# Altium project EEG.PrjPcb
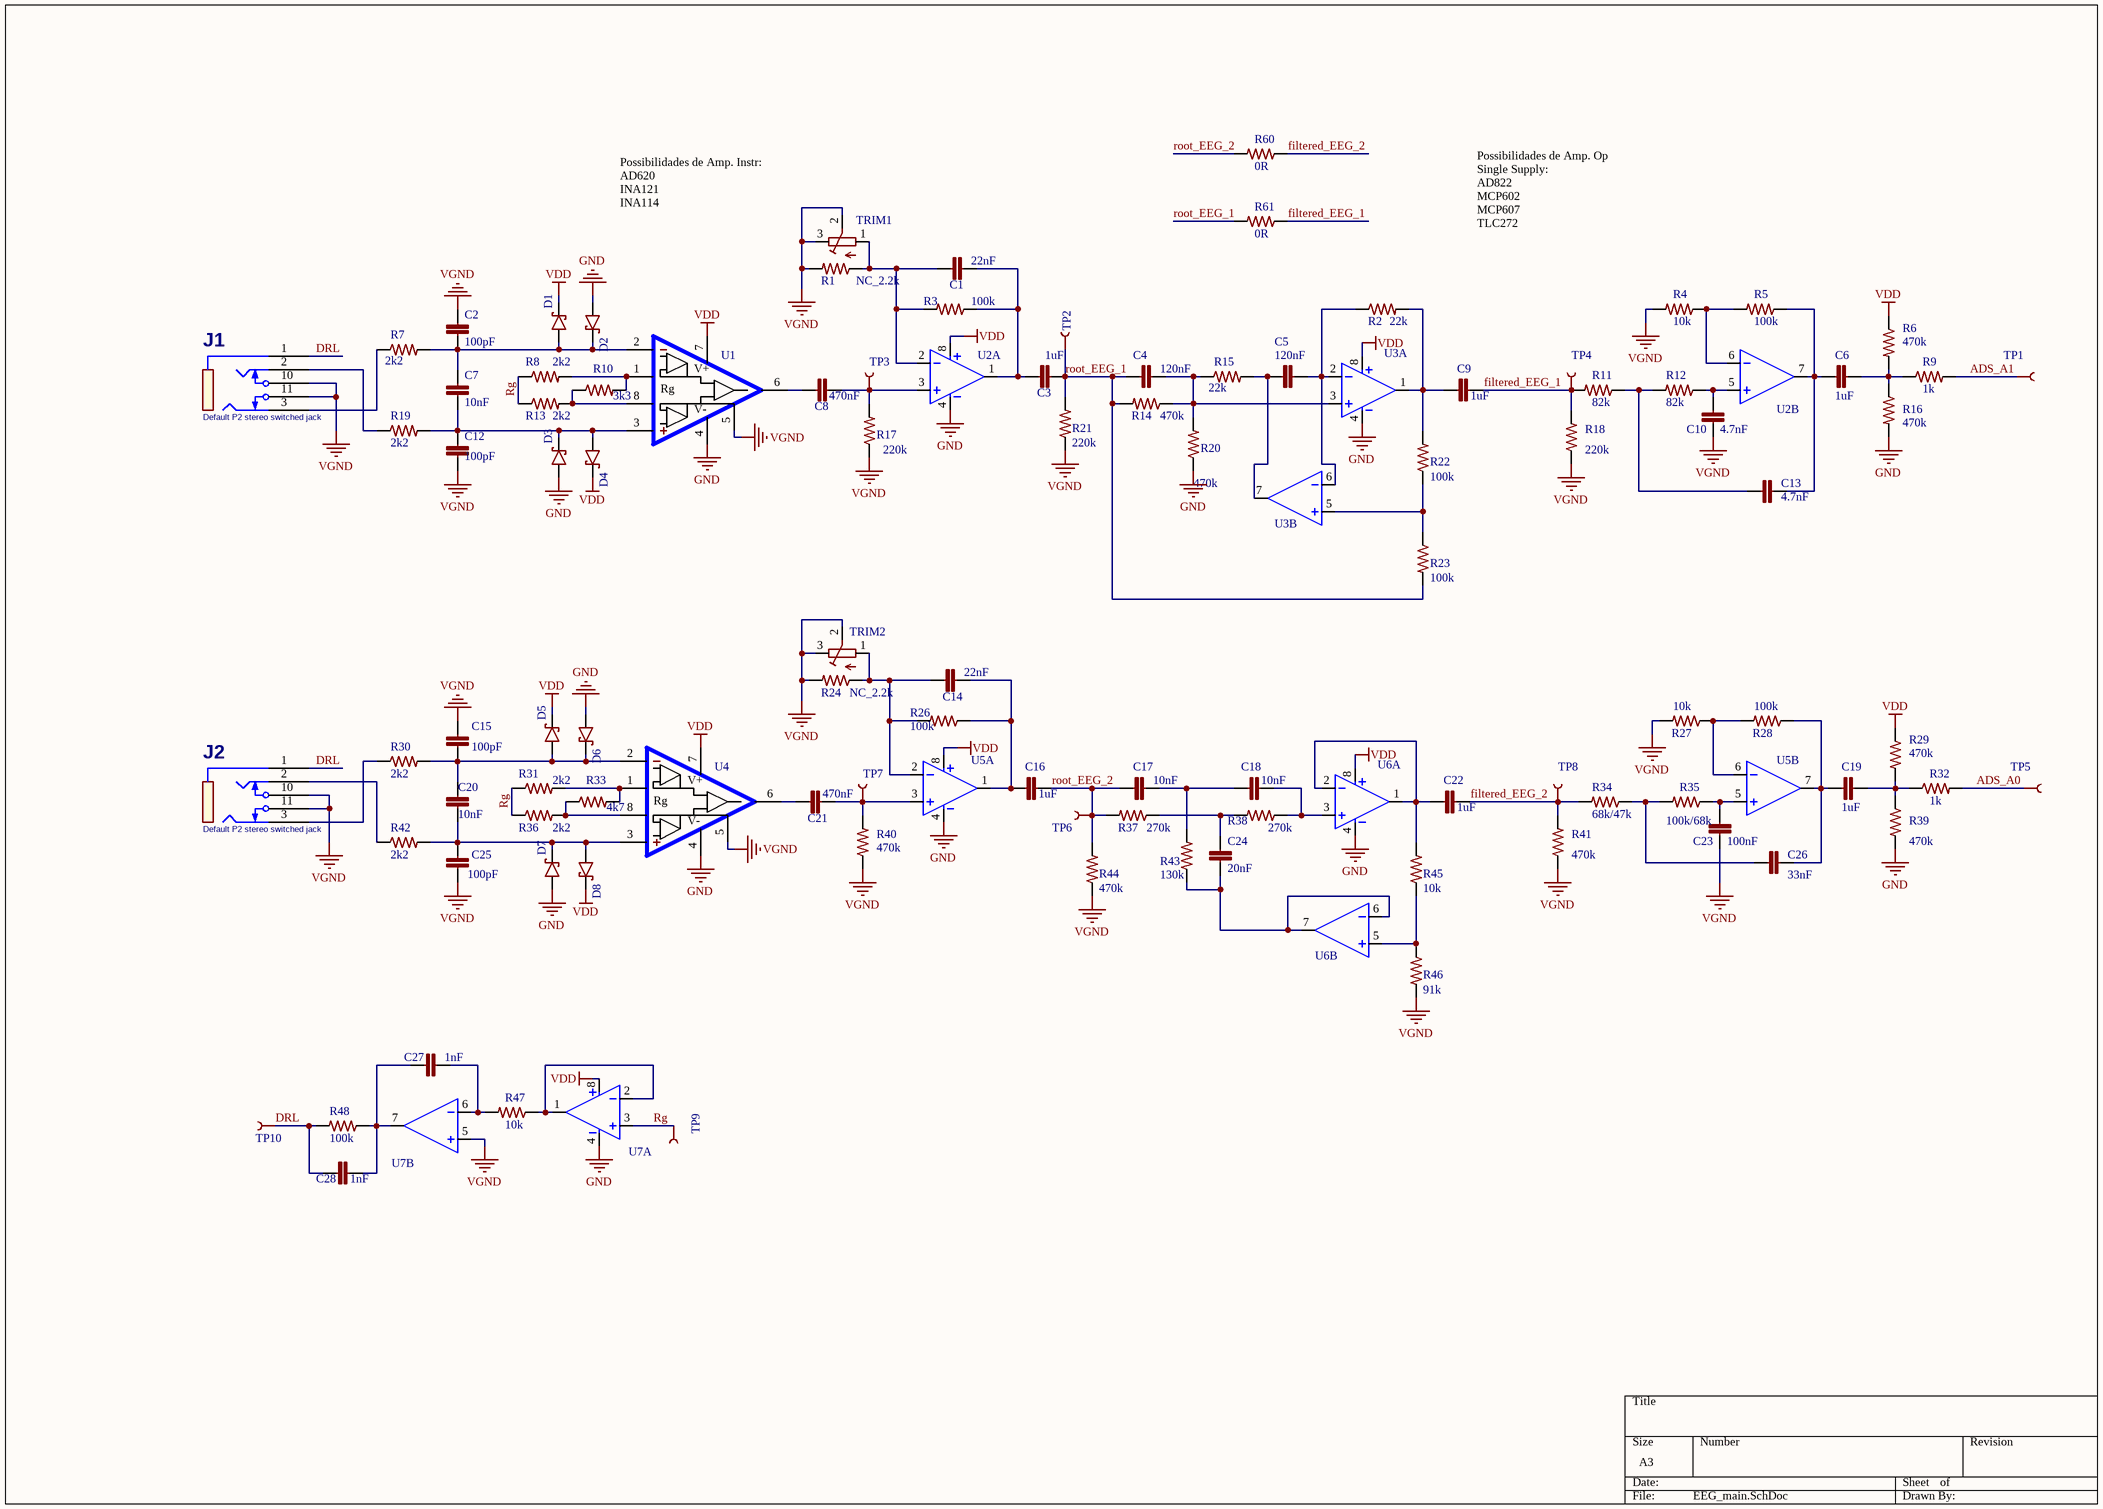
[diagram p0: EEG_main.SchDoc]
2 sheets, 136 parts. Net scope: global (net labels, ports and power ports of the same name join across sheets).
Board file: EEG.PcbDoc
Sheets:
  EEG_main.SchDoc
  EEG_Power_Connector_ESP32.SchDoc

## Sheet EEG_main.SchDoc
size A3

### Parts
C1  22nF  [C0805 - rounded]
C2  100pF  [C0805 - rounded]
C3  1uF  [C0805 - rounded]
C4  120nF  [C0805 - rounded]
C5  120nF  [C0805 - rounded]
C6  1uF  [C0805 - rounded]
C7  10nF  [C0805 - rounded]
C8  470nF  [C0805 - rounded]
C9  1uF  [C0805 - rounded]
C10  4.7nF  [C0805 - rounded]
C12  100pF  [C0805 - rounded]
C13  4.7nF  [C0805 - rounded]
C14  22nF  [C0805 - rounded]
C15  100pF  [C0805 - rounded]
C16  1uF  [C0805 - rounded]
C17  10nF  [C0805 - rounded]
C18  10nF  [C0805 - rounded]
C19  1uF  [C0805 - rounded]
C20  10nF  [C0805 - rounded]
C21  470nF  [C0805 - rounded]
C22  1uF  [C0805 - rounded]
C23  100nF  [C0805 - rounded]
C24  20nF  [C0805 - rounded]
C25  100pF  [C0805 - rounded]
C26  33nF  [C0805 - rounded]
C27  1nF  [C0805 - rounded]
C28  1nF  [C0805 - rounded]
D1  DIODE  [DO214AA]  (value not drawn)
D2  DIODE  [DO214AA]  (value not drawn)
D3  DIODE  [DO214AA]  (value not drawn)
D4  DIODE  [DO214AA]  (value not drawn)
D5  DIODE  [DO214AA]  (value not drawn)
D6  DIODE  [DO214AA]  (value not drawn)
D7  DIODE  [DO214AA]  (value not drawn)
D8  DIODE  [DO214AA]  (value not drawn)
J1  Default P2 stereo switched jack  [phone jack - SJ1-352x]
J2  Default P2 stereo switched jack  [phone jack - SJ1-352x]
R1  NC_2.2k  [R0805 - rounded]
R2  22k  [R0805 - rounded]
R3  100k  [R0805 - rounded]
R4  10k  [R0805 - rounded]
R5  100k  [R0805 - rounded]
R6  470k  [R0805 - rounded]
R7  2k2  [R0805 - rounded]
R8  2k2  [R0805 - rounded]
R9  1k  [R0805 - rounded]
R10  3k3  [R0805 - rounded]
R11  82k  [R0805 - rounded]
R12  82k  [R0805 - rounded]
R13  2k2  [R0805 - rounded]
R14  470k  [R0805 - rounded]
R15  22k  [R0805 - rounded]
R16  470k  [R0805 - rounded]
R17  220k  [R0805 - rounded]
R18  220k  [R0805 - rounded]
R19  2k2  [R0805 - rounded]
R20  470k  [R0805 - rounded]
R21  220k  [R0805 - rounded]
R22  100k  [R0805 - rounded]
R23  100k  [R0805 - rounded]
R24  NC_2.2k  [R0805 - rounded]
R26  100k  [R0805 - rounded]
R27  10k  [R0805 - rounded]
R28  100k  [R0805 - rounded]
R29  470k  [R0805 - rounded]
R30  2k2  [R0805 - rounded]
R31  2k2  [R0805 - rounded]
R32  1k  [R0805 - rounded]
R33  4k7  [R0805 - rounded]
R34  68k/47k  [R0805 - rounded]
R35  100k/68k  [R0805 - rounded]
R36  2k2  [R0805 - rounded]
R37  270k  [R0805 - rounded]
R38  270k  [R0805 - rounded]
R39  470k  [R0805 - rounded]
R40  470k  [R0805 - rounded]
R41  470k  [R0805 - rounded]
R42  2k2  [R0805 - rounded]
R43  130k  [R0805 - rounded]
R44  470k  [R0805 - rounded]
R45  10k  [R0805 - rounded]
R46  91k  [R0805 - rounded]
R47  10k  [R0805 - rounded]
R48  100k  [R0805 - rounded]
R60  0R  [R0805 - rounded]
R61  0R  [R0805 - rounded]
TP1  SparkFun Test Points    Bare copper test points for troubleshooting or In-Circuit-Testing. These are used by our Production team for verifying production board runs using pogo-pins on test beds.   SparkFun Products: SparkFun LSM9DS1 Breakout  SparkFun PSOC  SparkFun Load Cell Amplifier  [PAD.03X.03]  (value not drawn)
TP2  SparkFun Test Points    Bare copper test points for troubleshooting or In-Circuit-Testing. These are used by our Production team for verifying production board runs using pogo-pins on test beds.   SparkFun Products: SparkFun LSM9DS1 Breakout  SparkFun PSOC  SparkFun Load Cell Amplifier  [PAD.03X.03]  (value not drawn)
TP3  SparkFun Test Points    Bare copper test points for troubleshooting or In-Circuit-Testing. These are used by our Production team for verifying production board runs using pogo-pins on test beds.   SparkFun Products: SparkFun LSM9DS1 Breakout  SparkFun PSOC  SparkFun Load Cell Amplifier  [PAD.03X.03]  (value not drawn)
TP4  SparkFun Test Points    Bare copper test points for troubleshooting or In-Circuit-Testing. These are used by our Production team for verifying production board runs using pogo-pins on test beds.   SparkFun Products: SparkFun LSM9DS1 Breakout  SparkFun PSOC  SparkFun Load Cell Amplifier  [PAD.03X.03]  (value not drawn)
TP5  SparkFun Test Points    Bare copper test points for troubleshooting or In-Circuit-Testing. These are used by our Production team for verifying production board runs using pogo-pins on test beds.   SparkFun Products: SparkFun LSM9DS1 Breakout  SparkFun PSOC  SparkFun Load Cell Amplifier  [PAD.03X.03]  (value not drawn)
TP6  SparkFun Test Points    Bare copper test points for troubleshooting or In-Circuit-Testing. These are used by our Production team for verifying production board runs using pogo-pins on test beds.   SparkFun Products: SparkFun LSM9DS1 Breakout  SparkFun PSOC  SparkFun Load Cell Amplifier  [PAD.03X.03]  (value not drawn)
TP7  SparkFun Test Points    Bare copper test points for troubleshooting or In-Circuit-Testing. These are used by our Production team for verifying production board runs using pogo-pins on test beds.   SparkFun Products: SparkFun LSM9DS1 Breakout  SparkFun PSOC  SparkFun Load Cell Amplifier  [PAD.03X.03]  (value not drawn)
TP8  SparkFun Test Points    Bare copper test points for troubleshooting or In-Circuit-Testing. These are used by our Production team for verifying production board runs using pogo-pins on test beds.   SparkFun Products: SparkFun LSM9DS1 Breakout  SparkFun PSOC  SparkFun Load Cell Amplifier  [PAD.03X.03]  (value not drawn)
TP9  SparkFun Test Points    Bare copper test points for troubleshooting or In-Circuit-Testing. These are used by our Production team for verifying production board runs using pogo-pins on test beds.   SparkFun Products: SparkFun LSM9DS1 Breakout  SparkFun PSOC  SparkFun Load Cell Amplifier  [PAD.03X.03]  (value not drawn)
TP10  SparkFun Test Points    Bare copper test points for troubleshooting or In-Circuit-Testing. These are used by our Production team for verifying production board runs using pogo-pins on test beds.   SparkFun Products: SparkFun LSM9DS1 Breakout  SparkFun PSOC  SparkFun Load Cell Amplifier  [PAD.03X.03]  (value not drawn)
TRIM1  R-TRIMM  [RTRIM3386]  (value not drawn)
TRIM2  R-TRIMM  [RTRIM3386]  (value not drawn)
U1  AD620  [SOIC8]  (value not drawn)
U2  MCP602  [SOIC8]  (value not drawn)  (parts A,B of 2)
U3  MCP602  [SOIC8]  (value not drawn)  (parts A,B of 2)
U4  AD620  [SOIC8]  (value not drawn)
U5  MCP602  [SOIC8]  (value not drawn)  (parts A,B of 2)
U6  MCP602  [SOIC8]  (value not drawn)  (parts A,B of 2)
U7  MCP602  [SOIC8]  (value not drawn)  (parts A,B of 2)

### Nets
GND: D2.A D3.A D6.A D7.A R16.2 R20.1 R39.2 U1.4(V-) U2.4(V-) U3.4(V-) U4.4(V-) U5.4(V-) U6.4(V-) U7.4(V-)
VDD: D1.C D4.C D5.C D8.C R6.1 R29.1 U1.7(V+) U2.8(V+) U3.8(V+) U4.7(V+) U5.8(V+) U6.8(V+) U7.8(V+)
VGND: C2.2 C10.1 C12.2 C15.2 C23.1 C25.2 J1.10(TIP_SW) J1.11(RING_SW) J2.10(TIP_SW) J2.11(RING_SW) R1.2 R4.2 R17.1 R18.1 R21.1 R24.2 R27.2 R40.1 R41.1 R44.1 R46.2 TRIM1.2(S) TRIM1.3(E) TRIM2.2(S) TRIM2.3(E) U1.5(REF) U4.5(REF) U7.5(+IN)  [project net 2.5Vref]
ADS_A0: R32.2 TP5.P$1
ADS_A1: R9.2 TP1.P$1
DRL: C28.1 J1.1(SLEEVE) J2.1(SLEEVE) R48.2 TP10.P$1
filtered_EEG_1: C9.2 R11.2 R18.2 R61.1 TP4.P$1
filtered_EEG_2: C22.2 R34.2 R41.2 R60.1 TP8.P$1
Rg: R8.1 R13.1 R31.1 R36.1 TP9.P$1 U7.3(+IN)
root_EEG_1: C3.2 C4.1 R14.2 R21.2 R23.2 R61.2 TP2.P$1
root_EEG_2: C16.2 C17.1 R37.2 R44.2 R60.2 TP6.P$1
NetC1_1: C1.1 R1.1 R3.2 TRIM1.1(A) U2.2(-IN)
NetC1_2: C1.2 C3.1 R3.1 U2.1(OUT)
NetC2_1: C2.1 C7.2 D1.A D2.C R7.2 U1.2(-IN)
NetC4_2: C4.2 R14.1 R15.1 R20.2 U3.3(+IN)
NetC5_1: C5.1 R15.2 U3.7(OUT)
NetC5_2: C5.2 R2.1 U3.2(-IN) U3.6(-IN)
NetC6_1: C6.1 C13.1 R5.1 U2.7(OUT)
NetC6_2: C6.2 R6.2 R9.1 R16.1
NetC7_1: C7.1 C12.1 D3.C D4.A R19.2 U1.3(+IN)
NetC8_1: C8.1 U1.6(OUT)
NetC8_2: C8.2 R17.2 TP3.P$1 U2.3(+IN)
NetC9_1: C9.1 R2.2 R22.2 U3.1(OUT)
NetC10_2: C10.2 R12.1 U2.5(+IN)
NetC13_2: C13.2 R11.1 R12.2
NetC14_1: C14.1 R24.1 R26.2 TRIM2.1(A) U5.2(-IN)
NetC14_2: C14.2 C16.1 R26.1 U5.1(OUT)
NetC15_1: C15.1 C20.2 D5.A D6.C R30.2 U4.2(-IN)
NetC17_2: C17.2 C18.1 R43.2
NetC18_2: C18.2 R38.1 U6.3(+IN)
NetC19_1: C19.1 C26.1 R28.1 U5.7(OUT)
NetC19_2: C19.2 R29.2 R32.1 R39.1
NetC20_1: C20.1 C25.1 D7.C D8.A R42.2 U4.3(+IN)
NetC21_1: C21.1 U4.6(OUT)
NetC21_2: C21.2 R40.2 TP7.P$1 U5.3(+IN)
NetC22_1: C22.1 R45.2 U6.1(OUT) U6.2(-IN)
NetC23_2: C23.2 R35.1 U5.5(+IN)
NetC24_1: C24.1 R43.1 U6.6(-IN) U6.7(OUT)
NetC24_2: C24.2 R37.1 R38.2
NetC26_2: C26.2 R34.1 R35.2
NetC27_1: C27.1 C28.2 R48.1 U7.7(OUT)
NetC27_2: C27.2 R47.2 U7.6(-IN)
NetJ1_2: J1.2(TIP) R19.1
NetJ1_3: J1.3(RING) R7.1
NetJ2_2: J2.2(TIP) R42.1
NetJ2_3: J2.3(RING) R30.1
NetR4_1: R4.1 R5.2 U2.6(-IN)
NetR8_2: R8.2 R10.2 U1.1(Rg)
NetR10_1: R10.1 R13.2 U1.8(Rg)
NetR22_1: R22.1 R23.1 U3.5(+IN)
NetR27_1: R27.1 R28.2 U5.6(-IN)
NetR31_2: R31.2 R33.2 U4.1(Rg)
NetR33_1: R33.1 R36.2 U4.8(Rg)
NetR45_1: R45.1 R46.1 U6.5(+IN)
NetR47_1: R47.1 U7.1(OUT) U7.2(-IN)

### Notes on the sheet
- Possibilidades de Amp. Instr:
  AD620
  INA121
  INA114
- Possibilidades de Amp. Op Single Supply:
  AD822
  MCP602
  MCP607
  TLC272

### Library data of the parts
C1-C10 C12-C28 = C-EU-SMD: Generic Capacitor SMD
  C1 C14: Value: 22nF
  C2 C12 C15 C25: Value: 100pF
  C3 C6 C9 C16 C19 C22: Value: 1uF
  C4 C5: Value: 120nF
  C7 C17 C18 C20: Value: 10nF
  C8 C21: Value: 470nF
  C10 C13: Value: 4.7nF
  C23: Value: 100nF
  C24: Value: 20nF
  C26: Value: 33nF
  C27 C28: Value: 1nF
D1-D8 = SCHOTTKY-DIODE: Part Number: SS12
J1 J2 = PHONEJACK - SJ1-352x
R1-R24 R26-R48 R60 R61 = R-US-SMD: Generic Resistor SMD
  R1 R24: Value: NC_2.2k
  R2 R15: Value: 22k
  R3 R5 R22 R23 R26 R28 R48: Value: 100k
  R4 R27 R45 R47: Value: 10k
  R6 R14 R16 R20 R29 R39-R41 R44: Value: 470k
  R7 R8 R13 R19 R30 R31 R36 R42: Value: 2k2
  R9 R32: Value: 1k
  R10: Value: 3k3
  R11 R12: Value: 82k
  R17 R18 R21: Value: 220k
  R33: Value: 4k7
  R34: Value: 68k/47k
  R35: Value: 100k/68k
  R37 R38: Value: 270k
  R43: Value: 130k
  R46: Value: 91k
  R60 R61: Value: 0R
TP1-TP10 = TEST-POINT2
TRIM1 TRIM2 = R-TRIMM: Value: 100k
U1 U4 = AD620: Low Cost Low Power Instrumentation Amplifier
U2 U3 U5 U6 = MCP602: Operational Amplifiers - Op Amps Dual 2.7V; Vendor: Microchip; Part Number: MCP602
U7 = TL082: Wide Bandwidth Dual JFET Input Op Amp; Part Number: MCP602

## Sheet EEG_Power_Connector_ESP32.SchDoc
size A4
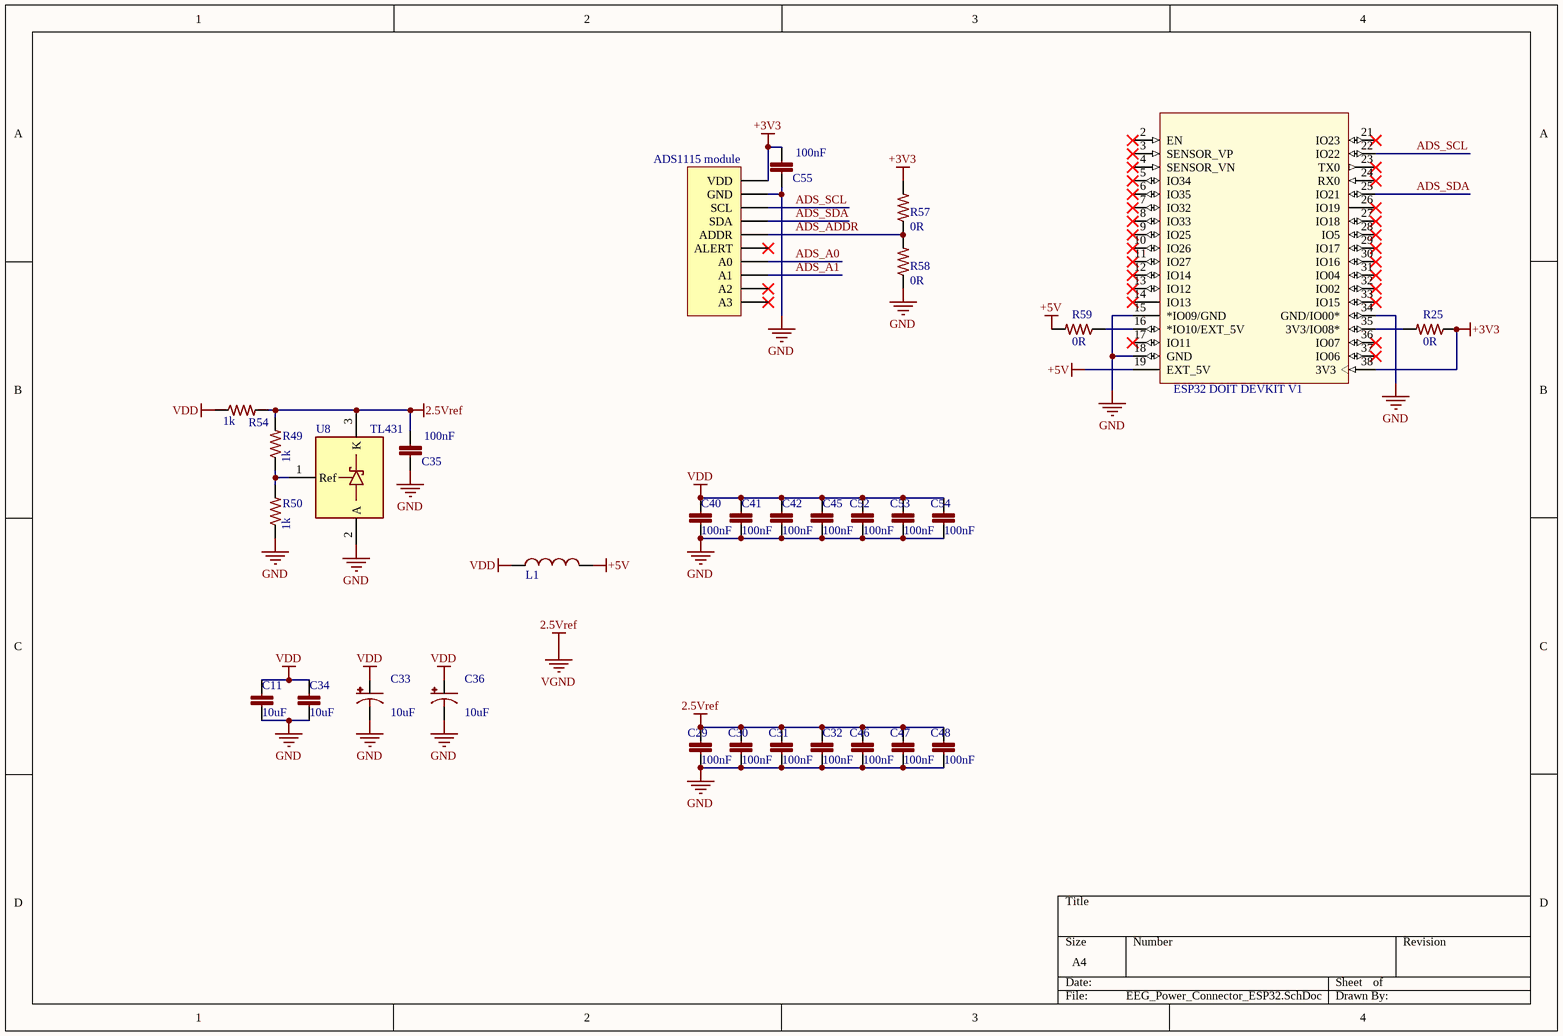
[diagram p1: EEG_Power_Connector_ESP32.SchDoc]

### Parts
A2  ESP32 DOIT DEVKIT V1  [MODULE_ESP32-DOIT_DEVKIT-36P]
A4  ADS1115 module  [ADS1115 Module - horizontal]
C11  10uF  [C0805 - rounded]
C29  100nF  [C0805 - rounded]
C30  100nF  [C0805 - rounded]
C31  100nF  [C0805 - rounded]
C32  100nF  [C0805 - rounded]
C33  10uF  [E1,8-4]
C34  10uF  [C0805 - rounded]
C35  100nF  [C0805 - rounded]
C36  10uF  [E1,8-4]
C40  100nF  [C0805 - rounded]
C41  100nF  [C0805 - rounded]
C42  100nF  [C0805 - rounded]
C45  100nF  [C0805 - rounded]
C46  100nF  [C0805 - rounded]
C47  100nF  [C0805 - rounded]
C48  100nF  [C0805 - rounded]
C52  100nF  [C0805 - rounded]
C53  100nF  [C0805 - rounded]
C54  100nF  [C0805 - rounded]
C55  100nF  [C0805 - rounded]
L1  Ferrite bead 0603  [L0805]  (value not drawn)
R25  0R  [R0805 - rounded]
R49  1k  [C0805]
R50  1k  [C0805]
R54  1k  [R0805 - rounded]
R57  0R  [R0805 - rounded]
R58  0R  [R0805 - rounded]
R59  0R  [R0805 - rounded]
U8  TL431  [TO92 - TL431]

### Nets
2.5Vref: C29.2 C30.2 C31.2 C32.2 C35.2 C46.2 C47.2 C48.2 R49.2 R54.2 U8.3(K)  [also labelled VGND]
+3V3: A2.38(3V3) A4.1(VDD) C55.1 R25.1 R57.2
+5V: A2.19(EXT_5V) L1.2 R59.2
GND: A2.15(*IO09/GND) A2.18(GND) A2.34(GND/IO00*) A4.2(GND) C11.1 C29.1 C30.1 C31.1 C32.1 C33.- C34.1 C35.1 C36.- C40.1 C41.1 C42.1 C45.1 C46.1 C47.1 C48.1 C52.1 C53.1 C54.1 C55.2 R50.1 R58.1 U8.2(A)
VDD: C11.2 C33.+ C34.2 C36.+ C40.2 C41.2 C42.2 C45.2 C52.2 C53.2 C54.2 L1.1 R54.1
ADS_A0: A4.7(A0)
ADS_A1: A4.8(A1)
ADS_ADDR: A4.5(ADDR) R57.1 R58.2
ADS_SCL: A2.22(IO22) A4.3(SCL)
ADS_SDA: A2.25(IO21) A4.4(SDA)
NetA2_16: A2.16(*IO10/EXT_5V) R59.1
NetA2_35: A2.35(3V3/IO08*) R25.2
NetR49_1: R49.1 R50.2 U8.1(Ref)

Not connected (* = marked no-connect by the designer): A2 2(EN)* 3(SENSOR_VP)* 4(SENSOR_VN)* 5(IO34)* 6(IO35)* 7(IO32)* 8(IO33)* 9(IO25)* 10(IO26)* 11(IO27)* 12(IO14)* 13(IO12)* 14(IO13)* 17(IO11)* 21(IO23)* 23(TX0)* 24(RX0)* 26(IO19)* 27(IO18)* 28(IO5)* 29(IO17)* 30(IO16)* 31(IO04)* 32(IO02)* 33(IO15)* 36(IO07)* 37(IO06)*; A4 6(ALERT)* 9(A2)* 10(A3)*

### Library data of the parts
A2 = ESP32-DEVKITC-38/38P: EVAL BOARD FOR ESP-WROOM-32; MP: ESP32-DEVKITC-32D; MF: Espressif Systems; SnapEDA_Link: https://www.snapeda.com/parts/ESP32-DEVKITC-32D/Espressif%20Systems/view-part/?ref=snap; Digi-Key_Part_Number: 1965-1000-ND; Digi-Key_Purchase_URL: https://www.digikey.tw/product-detail/en/espressif-systems/ESP32-DEVKITC-32D/1965-1000-ND/9356990?utm_source=snapeda&utm_medium=aggregator&utm_campaign=symbol; Package: None; Value: *
A4 = ADS1115 module: 16Bit I2C ADC+PGA; Vendor: Adafruit; Part Number: ADS1115 module
C11 C29-C32 C34 C35 C40-C42 C45-C48 C52-C55 = C-EU-SMD: Generic Capacitor SMD
  C11 C34: Value: 10uF
  C29-C32 C35 C40-C42 C45-C48 C52-C55: Value: 100nF
C33 C36 = CPOL-US-PTH: Genereric Polarized Capacitor PTH; Value: 10uF
L1 = L-US0805
R25 R49 R50 R54 R57-R59 = R-US-SMD: Generic Resistor SMD
  R25 R57-R59: Value: 0R
  R49 R50 R54: Value: 1k
U8 = TL431: Voltage References Rail Virtual Ground; Part Number: TL431

## Nets that join several sheets
2.5Vref: EEG_main (28 pins), EEG_Power_Connector_ESP32 (11 pins)
GND: EEG_main (14 pins), EEG_Power_Connector_ESP32 (27 pins)
VDD: EEG_main (13 pins), EEG_Power_Connector_ESP32 (13 pins)
ADS_A0: EEG_main (R32.2 TP5.P$1), EEG_Power_Connector_ESP32 (A4.7)
ADS_A1: EEG_main (R9.2 TP1.P$1), EEG_Power_Connector_ESP32 (A4.8)